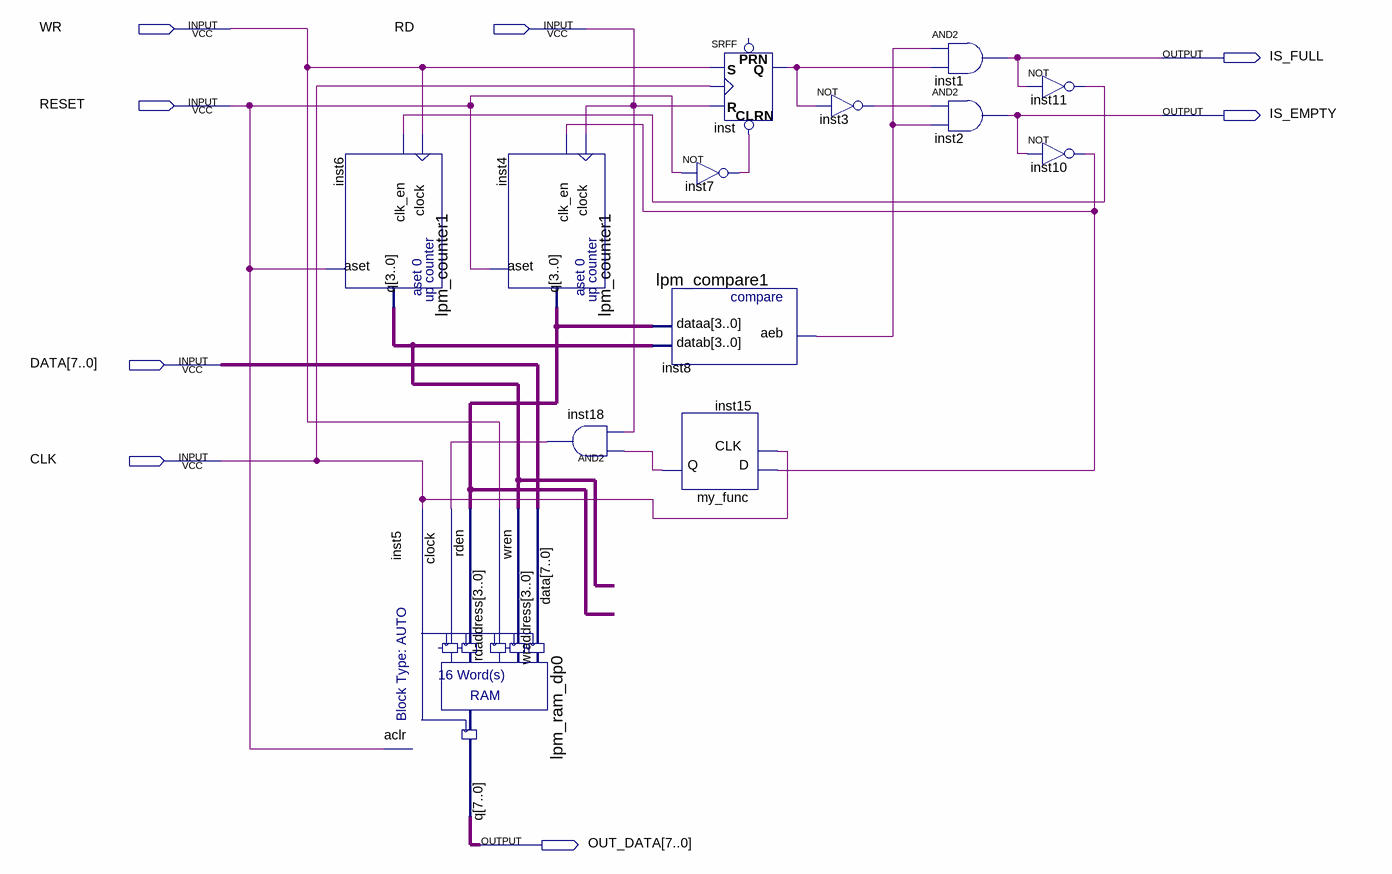
[diagram p0: schematic sheet]
// Quartus schematic fifo.bdf as structural Verilog: 13 symbols, 8 pins
module fifo (
  input  WR,
  input  RD,
  input  RESET,
  input  [7:0] DATA,
  input  CLK,
  output IS_FULL,
  output IS_EMPTY,
  output [7:0] OUT_DATA
);

  wire inst3_out, inst7_out, inst8_aeb, inst10_out, inst11_out, inst15_q, inst18_out, inst_q;
  wire [3:0] inst4_q, inst6_q;

  lpm_counter1 inst6 (.clock(WR), .clk_en(inst11_out), .aset(RESET), .q(inst6_q));
  lpm_ram_dp0 inst5 (
    .data(DATA), .wraddress(inst6_q), .wren(WR), .rdaddress(inst4_q), .rden(inst18_out), .clock(CLK),
    .aclr(RESET), .q(OUT_DATA));
  lpm_counter1 inst4 (.clock(RD), .clk_en(inst10_out), .aset(RESET), .q(inst4_q));
  and inst18 (inst18_out, inst15_q, RD);
  lpm_compare1 inst8 (.dataa(inst4_q), .datab(inst6_q), .aeb(inst8_aeb));
  my_func inst15 (.D(inst10_out), .CLK(CLK), .Q(inst15_q));
  SRFF inst (.CLRN(inst7_out), .S(WR), .R(RD), .CLK(CLK), .Q(inst_q));  // open: PRN
  not inst7 (inst7_out, RESET);
  not inst3 (inst3_out, inst_q);
  and inst1 (IS_FULL, inst8_aeb, inst_q);
  and inst2 (IS_EMPTY, inst3_out, inst8_aeb);
  not inst11 (inst11_out, IS_FULL);
  not inst10 (inst10_out, IS_EMPTY);
endmodule
